# EAGLE design scsi2sd (EAGLE 9.1.0)
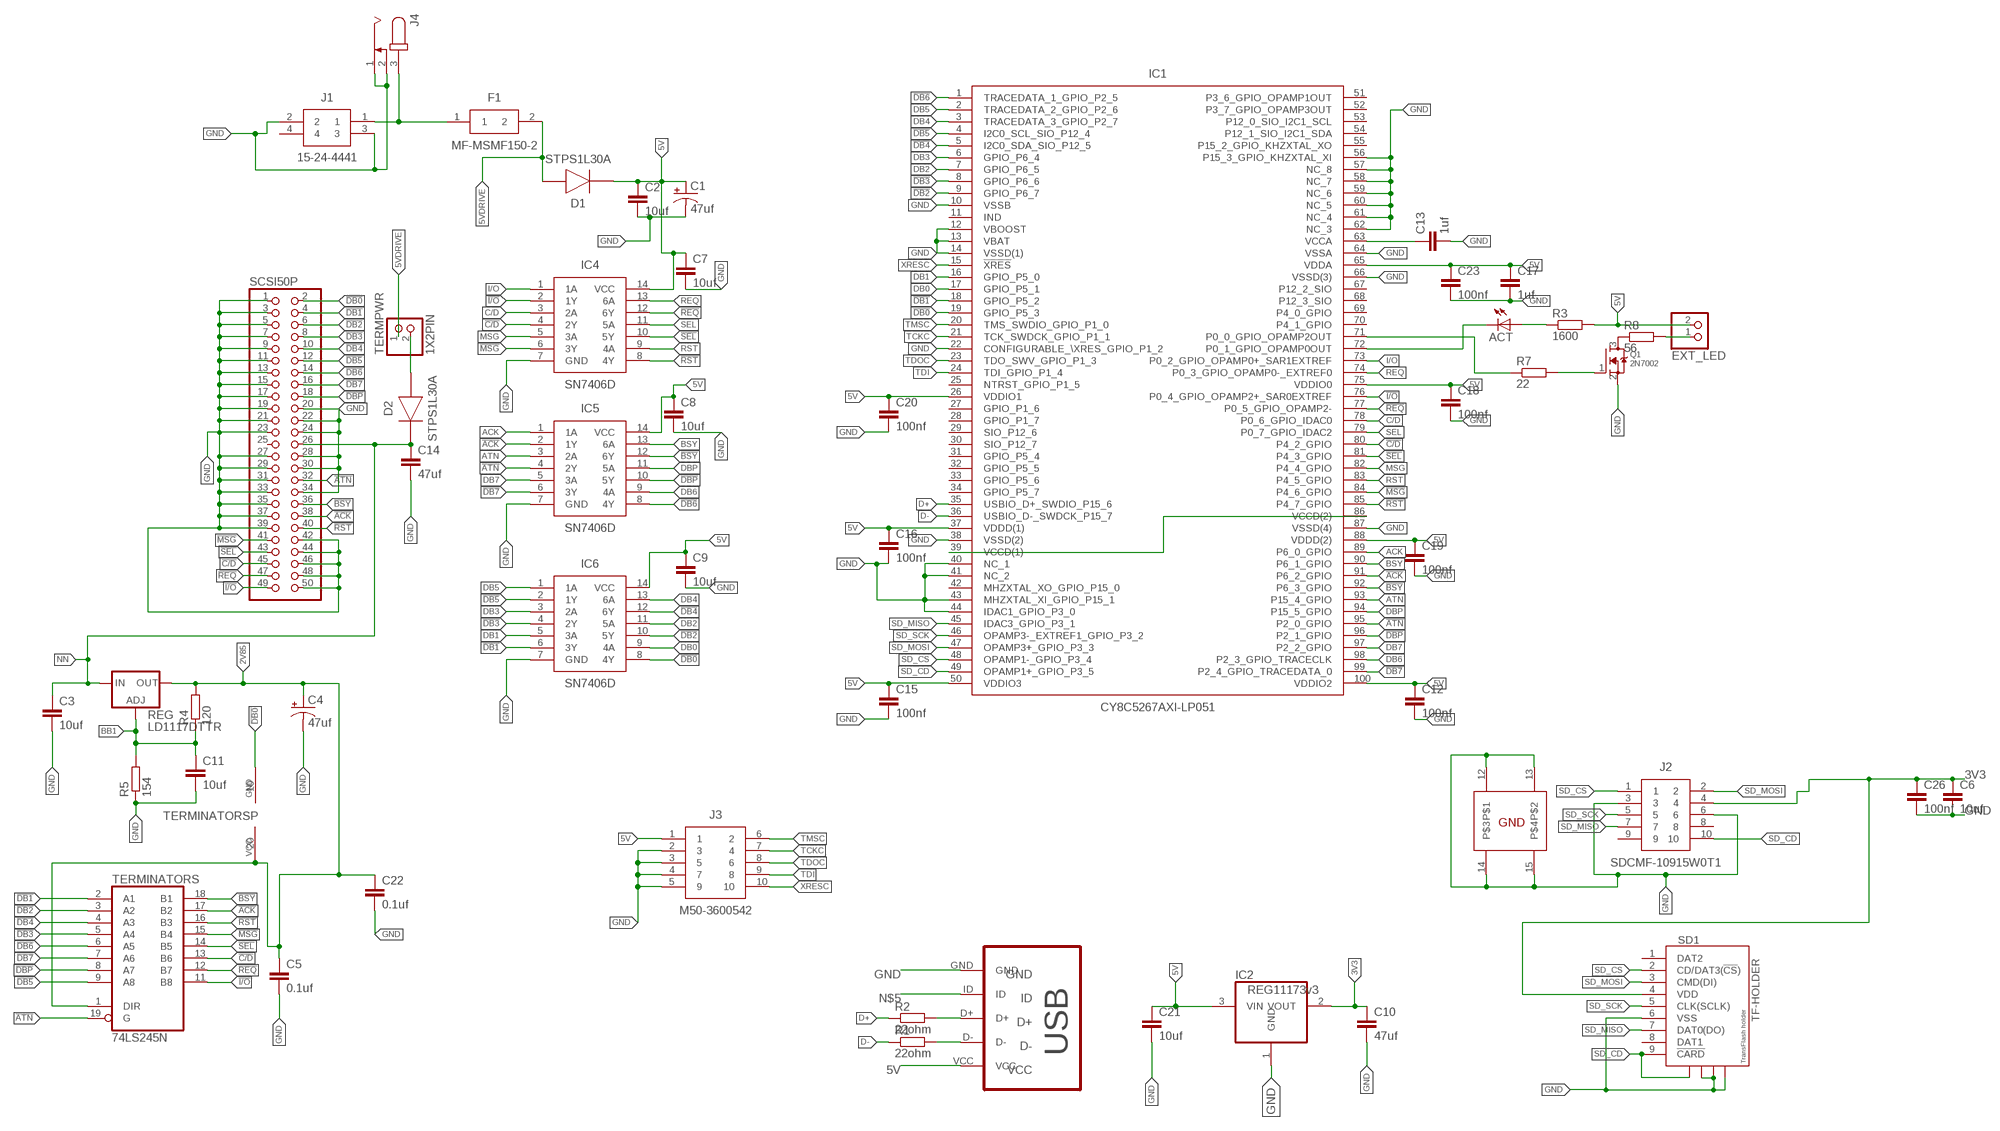
[diagram p0: schematic, sheet 1]

## Parts
ACT  LEDCHIPLED_0805  [CHIPLED_0805]
C1  47uf  CPOL-USE2.5-5  [E2,5-5]
C2  10uf  C-EUC0603  [C0603]
C3  10uf  C-EUC0603  [C0603]
C4  47uf  CPOL-USE2.5-5  [E2,5-5]
C5  0.1uf  C-EUC0603  [C0603]
C6  10uf  C-EUC0603  [C0603]
C7  10uf  C-EUC0603  [C0603]
C8  10uf  C-EUC0603  [C0603]
C9  10uf  C-EUC0603  [C0603]
C10  47uf  C-EUC0603  [C0603]
C11  10uf  C-EUC0603  [C0603]
C12  100nf  C-EUC0603  [C0603]
C13  1uf  C-EUC0603  [C0603]
C14  47uf  C-EUC1206  [C1206]
C15  100nf  C-EUC0603  [C0603]
C16  100nf  C-EUC0603  [C0603]
C17  1uf  C-EUC0603  [C0603]
C18  100nf  C-EUC0603  [C0603]
C19  100nf  C-EUC0603  [C0603]
C20  100nf  C-EUC0603  [C0603]
C21  10uf  C-EUC0603  [C0603]
C22  0.1uf  C-EUC0603  [C0603]
C23  100nf  C-EUC0603  [C0603]
C26  100nf  C-EUC0603  [C0603]
D1  STPS1L30A  [DIOM5226X223N]
D2  STPS1L30A  [DIOM5226X223N]
EXT_LED  1X2PIN  [1X2PIN]
F1  MF-MSMF150-2  [FUSC4632X85N]
IC1  CY8C5267AXI-LP051  [TQFP50P1600X1600X160-100N]
IC2  REG11173v3  REG1117  [SOT223]
IC4  SN7406D  [SOIC127P600X175-14N]
IC5  SN7406D  [SOIC127P600X175-14N]
IC6  SN7406D  [SOIC127P600X175-14N]
J1  15-24-4441  [15-24-4441]
J2  SDCMF-10915W0T1  [SDCMF-10915W0T1]
J3  M50-3600542  [HARWIN_10PIN_1.27PITCH_SMD]
J4  RAPC7120  [RAPC712]
Q1  2N7002  MOSFET-NREFLOW  [SOT23]
R1  22ohm  R-EU_R0603  [R0603]
R2  22ohm  R-EU_R0603  [R0603]
R3  1600  R-EU_R0603  [R0603]
R4  120  R-EU_R0603  [R0603]
R5  154  R-EU_R0603  [R0603]
R7  22  R-EU_R0603  [R0603]
R8  56  R-EU_R0603  [R0603]
REG  LD1117DTTR  LD117ADT12TR  [DPACK]
SCSI50P  PINHD-2X25/90  [2X25/90]
SD1  TF-HOLDER  [TF-PULL]
TERMINATORS  74LS245N  [DIL20]
TERMPWR  1X2PIN  [1X2PIN]
USB  MICRO-USB-B  [MICRO_USB_4_LEGS]

## Nets
2V85 [5V]: C4.+ C5.1 C22.1 R4.2 REG.4(OUT) TERMINATORS.1(DIR) TERMINATORS.20(VCC)
3V3 [2V85]: C6.1 C10.1 C26.1 IC2.2(VOUT) J2.4 SD1.4(VDD)
5V [5V]: C1.+ C2.1 C7.1 C8.1 C9.1 C12.1 C15.1 C16.1 C17.1 C18.1 C19.1 C20.1 C21.1 C23.1 D1.1(K) EXT_LED.2 IC1.26(VDDIO1) IC1.37(VDDD(1)) IC1.50(VDDIO3) IC1.65(VDDA) IC1.75(VDDIO0) IC1.88(VDDD(2)) IC1.100(VDDIO2) IC2.3(VIN) IC4.14(VCC) IC5.14(VCC) IC6.14(VCC) J3.1 R3.2 USB.VCC
5VDRIVE [5V]: D1.2(A) F1.2 TERMPWR.1
!ACK: IC1.91(P6_2_GPIO) IC5.2(1Y) SCSI50P.38 TERMINATORS.17(B2)
!ATN: IC1.95(P2_0_GPIO) IC5.4(2Y) SCSI50P.32 TERMINATORS.19(G)
!BSY: IC1.92(P6_3_GPIO) IC5.12(6Y) SCSI50P.36 TERMINATORS.18(B1)
!C/D: IC1.80(P4_2_GPIO) IC4.4(2Y) SCSI50P.45 TERMINATORS.13(B6)
!DB0: IC1.19(GPIO_P5_3) IC6.8(4Y) SCSI50P.2 TERMINATORS.10(GND)
!DB1: IC1.18(GPIO_P5_2) IC6.6(3Y) SCSI50P.4 TERMINATORS.2(A1)
!DB2: IC1.9(GPIO_P6_7) IC6.10(5Y) SCSI50P.6 TERMINATORS.3(A2)
!DB3: IC1.8(GPIO_P6_6) IC6.4(2Y) SCSI50P.8 TERMINATORS.5(A4)
!DB4: IC1.5(I2C0_SDA_SIO_P12_5) IC6.12(6Y) SCSI50P.10 TERMINATORS.4(A3)
!DB5: IC1.4(I2C0_SCL_SIO_P12_4) IC6.2(1Y) SCSI50P.12 TERMINATORS.9(A8)
!DB6: IC1.1(TRACEDATA_1_GPIO_P2_5) IC5.8(4Y) SCSI50P.14 TERMINATORS.6(A5)
!DB7: IC1.99(P2_4_GPIO_TRACEDATA_0) IC5.6(3Y) SCSI50P.16 TERMINATORS.7(A6)
!DBP: IC1.96(P2_1_GPIO) IC5.10(5Y) SCSI50P.18 TERMINATORS.8(A7)
!I/O: IC1.76(P0_4_GPIO_OPAMP2+_SAR0EXTREF) IC4.2(1Y) SCSI50P.49 TERMINATORS.11(B8)
!MSG: IC1.84(P4_6_GPIO) IC4.6(3Y) SCSI50P.41 TERMINATORS.15(B4)
!REQ: IC1.77(P0_5_GPIO_OPAMP2-) IC4.12(6Y) SCSI50P.47 TERMINATORS.12(B7)
!RST: IC1.85(P4_7_GPIO) IC4.8(4Y) SCSI50P.40 TERMINATORS.16(B3)
!SEL: IC1.81(P4_3_GPIO) IC4.10(5Y) SCSI50P.43 TERMINATORS.14(B5)
ACK: IC1.89(P6_0_GPIO) IC5.1(1A)
ATN: IC1.93(P15_4_GPIO) IC5.3(2A)
BB1 [GND]: C11.1 R4.1 R5.2 REG.1(ADJ)
BSY: IC1.90(P6_1_GPIO) IC5.13(6A)
C/D: IC1.78(P0_6_GPIO_IDAC0) IC4.3(2A)
D+: IC1.35(USBIO_D+_SWDIO_P15_6) R2.1
D-: IC1.36(USBIO_D-_SWDCK_P15_7) R1.1
DB0: IC1.17(GPIO_P5_1) IC6.9(4A)
DB1: IC1.16(GPIO_P5_0) IC6.5(3A)
DB2: IC1.7(GPIO_P6_5) IC6.11(5A)
DB3: IC1.6(GPIO_P6_4) IC6.3(2A)
DB4: IC1.3(TRACEDATA_3_GPIO_P2_7) IC6.13(6A)
DB5: IC1.2(TRACEDATA_2_GPIO_P2_6) IC6.1(1A)
DB6: IC1.98(P2_3_GPIO_TRACECLK) IC5.9(4A)
DB7: IC1.97(P2_2_GPIO) IC5.5(3A)
DBP: IC1.94(P15_5_GPIO) IC5.11(5A)
GND [GND]: C1.- C2.2 C3.2 C4.- C5.2 C6.2 C7.2 C8.2 C9.2 C10.2 C11.2 C12.2 C13.2 C14.2 C15.2 C16.2 C17.2 C18.2 C19.2 C20.2 C21.2 C22.2 C23.2 C26.2 IC1.10(VSSB) IC1.12(VBOOST) IC1.13(VBAT) IC1.14(VSSD(1)) IC1.22(CONFIGURABLE_\XRES_GPIO_P1_2) IC1.38(VSSD(2)) IC1.40(NC_1) IC1.41(NC_2) IC1.43(MHZXTAL_XI_GPIO_P15_1) IC1.44(IDAC1_GPIO_P3_0) IC1.56(P15_3_GPIO_KHZXTAL_XI) IC1.57(NC_8) IC1.58(NC_7) IC1.59(NC_6) IC1.60(NC_5) IC1.61(NC_4) IC1.62(NC_3) IC1.64(VSSA) IC1.66(VSSD(3)) IC1.87(VSSD(4)) IC2.1(GND) IC4.7(GND) IC5.7(GND) IC6.7(GND) J1.2 J1.3 J2.3 J2.6 J2.12 J2.13 J2.14 J2.15 J3.2 J3.3 J3.4 J3.5 J4.1 J4.2 Q1.2(S) R5.1 SCSI50P.1 SCSI50P.3 SCSI50P.5 SCSI50P.7 SCSI50P.9 SCSI50P.11 SCSI50P.13 SCSI50P.15 SCSI50P.17 SCSI50P.19 SCSI50P.20 SCSI50P.21 SCSI50P.22 SCSI50P.23 SCSI50P.24 SCSI50P.27 SCSI50P.28 SCSI50P.29 SCSI50P.30 SCSI50P.31 SCSI50P.33 SCSI50P.34 SCSI50P.35 SCSI50P.37 SCSI50P.39 SCSI50P.42 SCSI50P.44 SCSI50P.46 SCSI50P.48 SCSI50P.50 SD1.6(VSS) SD1.S2 SD1.S3 SD1.S4 USB.GND
I/O: IC1.73(P0_2_GPIO_OPAMP0+_SAR1EXTREF) IC4.1(1A)
MSG: IC1.82(P4_4_GPIO) IC4.5(3A)
N$1: F1.1 J1.1 J4.3
N$2: R2.2 USB.D+
N$3: R1.2 USB.D-
N$5: USB.ID
N$6: ACT.A R3.1
N$7: IC1.71(P0_0_GPIO_OPAMP2OUT) R7.1
N$8: D2.2(A) TERMPWR.2
N$9: IC1.39(VCCD(1)) IC1.86(VCCD(2))
N$10: Q1.1(G) R7.2
N$12: Q1.3(D) R8.1
N$16: EXT_LED.1 R8.2
N$34: C13.1 IC1.63(VCCA)
N$35: ACT.C IC1.72(P0_1_GPIO_OPAMP0OUT)
NN [5V]: C3.1 C14.1 D2.1(K) REG.3(IN) SCSI50P.26
REQ: IC1.74(P0_3_GPIO_OPAMP0-_EXTREF0) IC4.13(6A)
RST: IC1.83(P4_5_GPIO) IC4.9(4A)
SD_CD: IC1.49(OPAMP1+_GPIO_P3_5) J2.10 SD1.9(!CARD) SD1.S1
SD_CS: IC1.48(OPAMP1-_GPIO_P3_4) J2.1 SD1.2(CD/DAT3(!CS!))
SD_MISO: IC1.45(IDAC3_GPIO_P3_1) J2.7 SD1.7(DAT0(DO))
SD_MOSI: IC1.47(OPAMP3+_GPIO_P3_3) J2.2 SD1.3(CMD(DI))
SD_SCK: IC1.46(OPAMP3-_EXTREF1_GPIO_P3_2) J2.5 SD1.5(CLK(SCLK))
SEL: IC1.79(P0_7_GPIO_IDAC2) IC4.11(5A)
TCKC: IC1.21(TCK_SWDCK_GPIO_P1_1) J3.7
TDI: IC1.24(TDI_GPIO_P1_4) J3.9
TDOC: IC1.23(TDO_SWV_GPIO_P1_3) J3.8
TMSC: IC1.20(TMS_SWDIO_GPIO_P1_0) J3.6
XRESC: IC1.15(!XRES) J3.10
Unconnected: IC1.11(IND) IC1.25(NTRST_GPIO_P1_5) IC1.27(GPIO_P1_6) IC1.28(GPIO_P1_7) IC1.29(SIO_P12_6) IC1.30(SIO_P12_7) IC1.31(GPIO_P5_4) IC1.32(GPIO_P5_5) IC1.33(GPIO_P5_6) IC1.34(GPIO_P5_7) IC1.42(MHZXTAL_XO_GPIO_P15_0) IC1.51(P3_6_GPIO_OPAMP1OUT) IC1.52(P3_7_GPIO_OPAMP3OUT) IC1.53(P12_0_SIO_I2C1_SCL) IC1.54(P12_1_SIO_I2C1_SDA) IC1.55(P15_2_GPIO_KHZXTAL_XO) IC1.67(P12_2_SIO) IC1.68(P12_3_SIO) IC1.69(P4_0_GPIO) IC1.70(P4_1_GPIO) J1.4 J2.8 J2.9 SCSI50P.25 SD1.1(DAT2) SD1.8(DAT1)

## Library data of the parts
ACT = adafruit:LED: LED OSRAM: - CHIPLED LG R971, LG N971, LY N971, LG Q971, LY Q971, LO R971, LY R971 LH N974, LH R974 LS Q976, LO Q976, LY Q976 LO Q996 - Hyper CHIPLED LW Q18S LB Q993, LB Q99A, LB R99A - SideLED LS A670, LO A670, LY A670, LG A670, LP A670 LB A673, LV A673, LT A673, LW A673 LH A674 LY A675 LS A676, LA A676, LO A676, LY A676, LW A676 LS A679, LY A679, LG A679 - Hyper Micro SIDELED® LS Y876, LA Y876, LO Y876, LY Y876 LT Y87S - SmartLED LW L88C, LW L88S LB L89C, LB L89S, LG L890 LS L89K, LO L89K, LY L89K LS L896, LA L896, LO L896, LY L896 - TOPLED LS T670, LO T670, LY T670, LG T670, LP T670 LSG T670, LSP T670, LSY T670, LOP T670, LYG T670 LG T671, LOG T671, LSG T671 LB T673, LV T673, LT T673, LW T673 LH T674 LS T676, LA T676, LO T676, LY T676, LB T676, LH T676, LSB T676, LW T676 LB T67C, LV T67C, LT T67C, LS T67K, LO T67K, LY T67K, LW E67C LS E67B, LA E67B, LO E67B, LY E67B, LB E67C, LV E67C, LT E67C LW T67C LS T679, LY T679, LG T679 LS T770, LO T770, LY T770, LG T770, LP T770 LB T773, LV T773, LT T773, LW T773 LH T774 LS E675, LA E675, LY E675, LS T675 LS T776, LA T776, LO T776, LY T776, LB T776 LHGB T686 LT T68C, LB T68C - Hyper Mini TOPLED® LB M676 - Mini TOPLED Santana® LG M470 LS M47K, LO M47K, LY M47K Source: http://www.osram.convergy.de/
C1 C4 = adafruit:CPOL-US: POLARIZED CAPACITOR, American symbol
C2 C3 C5-C23 C26 = rcl:C-EU: CAPACITOR, European symbol
D1 D2 = STPS1L30A:STPS1L30A: Schottky barrier diode,STPS1L30A SMA STMicroelectronics STPS1L30A, SMT Schottky Diode, 30V 1A, 2-Pin DO-214AC <https://componentsearchengine.com/Images/3/STPS1L30A.jpg> Source: Datasheet <http://www.st.com/web/en/resource/technical/document/datasheet/CD00001323.pdf>; DESCRIPTION: Schottky barrier diode,STPS1L30A SMA STMicroelectronics STPS1L30A, SMT Schottky Diode, 30V 1A, 2-Pin DO-214AC; HEIGHT: 2.23mm; MANUFACTURER_NAME: STMicroelectronics; MANUFACTURER_PART_NUMBER: STPS1L30A; RS_PART_NUMBER: 4858061; SUPPLIER_NAME: RS
EXT_LED = a3640_edu_v0.1:1X2PIN: 1 X 2 PIN
F1 = MF-MSMF150-2:MF-MSMF150-2: Fuse, PTC, Resettable, SMD, 1812, 1.5A Bourns 1.5A Surface Mount Resettable Fuse, 6 V <https://componentsearchengine.com/Images/3/MF-MSMF150-2.jpg> Source: Datasheet <https://componentsearchengine.com/Datasheets/2/MF-MSMF150-2.pdf>; DESCRIPTION: Fuse, PTC, Resettable, SMD, 1812, 1.5A Bourns 1.5A Surface Mount Resettable Fuse, 6 V; HEIGHT: 0.85mm; MANUFACTURER_NAME: Bourns; MANUFACTURER_PART_NUMBER: MF-MSMF150-2; RS_PART_NUMBER: 6478235; SUPPLIER_NAME: RS
IC1 = CY8C5267AXI-LP051:CY8C5267AXI-LP051: CY8C52LP Family <https://componentsearchengine.com/Images/1/CY8C5267AXI-LP051.jpg> Source: Datasheet <http://www.cypress.com/file/45936/download>; DESCRIPTION: CY8C52LP Family; HEIGHT: mm; MANUFACTURER_NAME: Cypress Semiconductor; MANUFACTURER_PART_NUMBER: CY8C5267AXI-LP051; RS_PART_NUMBER: 8282749; SUPPLIER_NAME: RS
IC2 = burr-brown:REG1117: 800mA and 1A Low Dropout (LDO) Positive Regulator 1.8V, 2.5V, 2.85V, 3.3V, 5V, and Adj; MPN: REG1117; OC_FARNELL: 1097566; OC_NEWARK: 14P6981
IC4-IC6 = SN7406D:SN7406D: SN7406D, Hex Inverter Buffer, Driver, Open Collector 40mA 5V 14-Pin SOIC <https://componentsearchengine.com/Images/3/SN7406D.jpg> Source: Datasheet <http://www.ti.com/lit/ds/symlink/sn7406.pdf>; DESCRIPTION: SN7406D, Hex Inverter Buffer, Driver, Open Collector 40mA 5V 14-Pin SOIC; HEIGHT: 1.75mm; MANUFACTURER_NAME: Texas Instruments; MANUFACTURER_PART_NUMBER: SN7406D; RS_PART_NUMBER: 6630739; SUPPLIER_NAME: RS
J1 = 15-24-4441:15-24-4441: 5.08mm Pitch Disk Drive Power Connection System Header <https://componentsearchengine.com/Images/3/15-24-4441.jpg> Source: Datasheet <http://docs-europe.electrocomponents.com/webdocs/13c2/0900766b813c2c8c.pdf>; DESCRIPTION: 5.08mm Pitch Disk Drive Power Connection System Header; HEIGHT: mm; MANUFACTURER_NAME: Molex; MANUFACTURER_PART_NUMBER: 15-24-4441; RS_PART_NUMBER: 6704256; SUPPLIER_NAME: RS
J2 = SDCMF-10915W0T1:SDCMF-10915W0T1: MULTICOMP - SDCMF-10915W0T1 - CONNECTOR, SD, METAL COVER, SMT, R/A Source: Datasheet <http://www.farnell.com/datasheets/12099.pdf>; DESCRIPTION: MULTICOMP - SDCMF-10915W0T1 - CONNECTOR, SD, METAL COVER, SMT, R/A; HEIGHT: mm; MANUFACTURER_NAME: MULTICOMP; MANUFACTURER_PART_NUMBER: SDCMF-10915W0T1; SUPPLIER_NAME: RS
J3 = M50-3600542:M50-3600542: HARWIN M50-36 Series, 1.27mm Pitch 10 Way 2 Row Straight PCB Header, Solder Termination, 1A <https://componentsearchengine.com/Images/3/M50-3600542.jpg> Source: Datasheet <http://docs-europe.electrocomponents.com/webdocs/1388/0900766b81388736.pdf>; DESCRIPTION: HARWIN M50-36 Series, 1.27mm Pitch 10 Way 2 Row Straight PCB Header, Solder Termination, 1A; HEIGHT: mm; MANUFACTURER_NAME: HARWIN; MANUFACTURER_PART_NUMBER: M50-3600542; RS_PART_NUMBER: 1224772; SUPPLIER_NAME: RS
J4 = RepRapjr:RAPC712: DC POWER JACK Power Jack, DC, Right Angle, Through Hole, Rated 5A at 16VDC, PC Terminals Distributor: Farnell (www.Farnell.de) Drawing: 84N1161.pdf / 84N1162.pdf Manufacturer: SPC Technology (www.spctechnology.com) Type: SPC4077 / SPC 4078
Q1 = TiLDA Mk3 Parts:MOSFET-N: N-Channel Mosfet 2N7002E - 60V 260mA SOT23 [Digikey: 2N7002ET1GOSTR-ND] - REEL BSH103 - 30V 850mA SOT23 [Digikey: 568-5013-1-ND]
R1-R5 R7 R8 = rcl:R-EU_: RESISTOR, European symbol
REG = v-reg:LD117A?*: Low drop fixed and adjustable positive voltage regulators 1 A Source: http://www.st.com/stonline/products/literature/ds/7194/ld1117axx.pdf
SCSI50P = pinhead:PINHD-2X25: PIN HEADER
SD1 = sd-mmc:TF-HOLDER: TF / Micro SD socket is PUSH-PUSH type, the card can be pushed into and auto locked and pushed out by simply press the card. Surface Mounting type.
TERMINATORS = 74xx-us:74*245: Octal BUS TRANSCEIVER, 3-state
TERMPWR = edu:1X2PIN: 1 X 2 PIN
USB = micro usb B - 4LEGS:MICRO-USB-B

## Net classes
1 5V: width 0.305 mm
2 GND: width 0.279 mm
3 2V85: width 0.406 mm

## Board
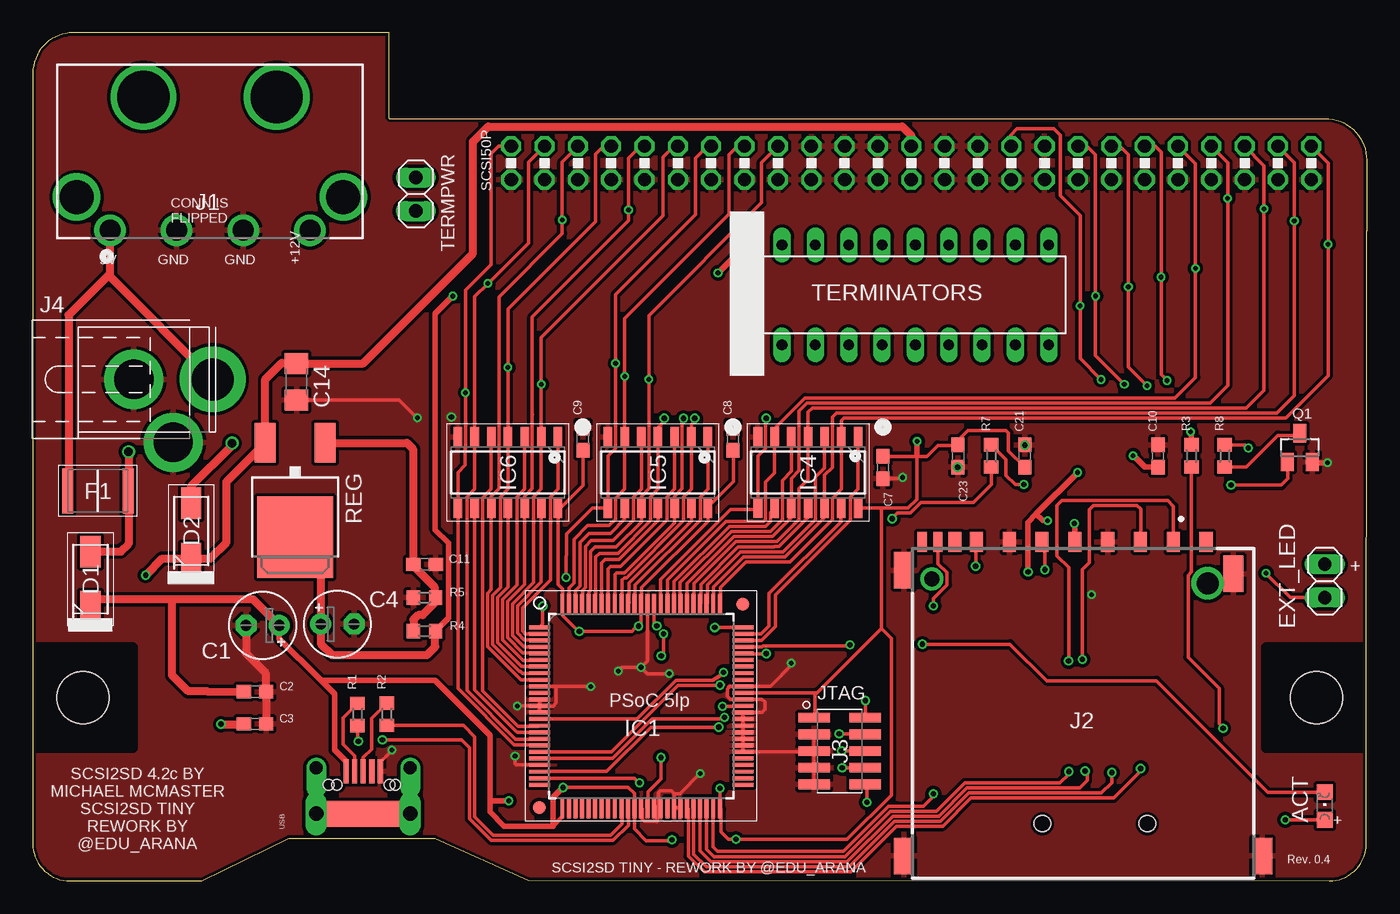
[diagram p1: board, top side]
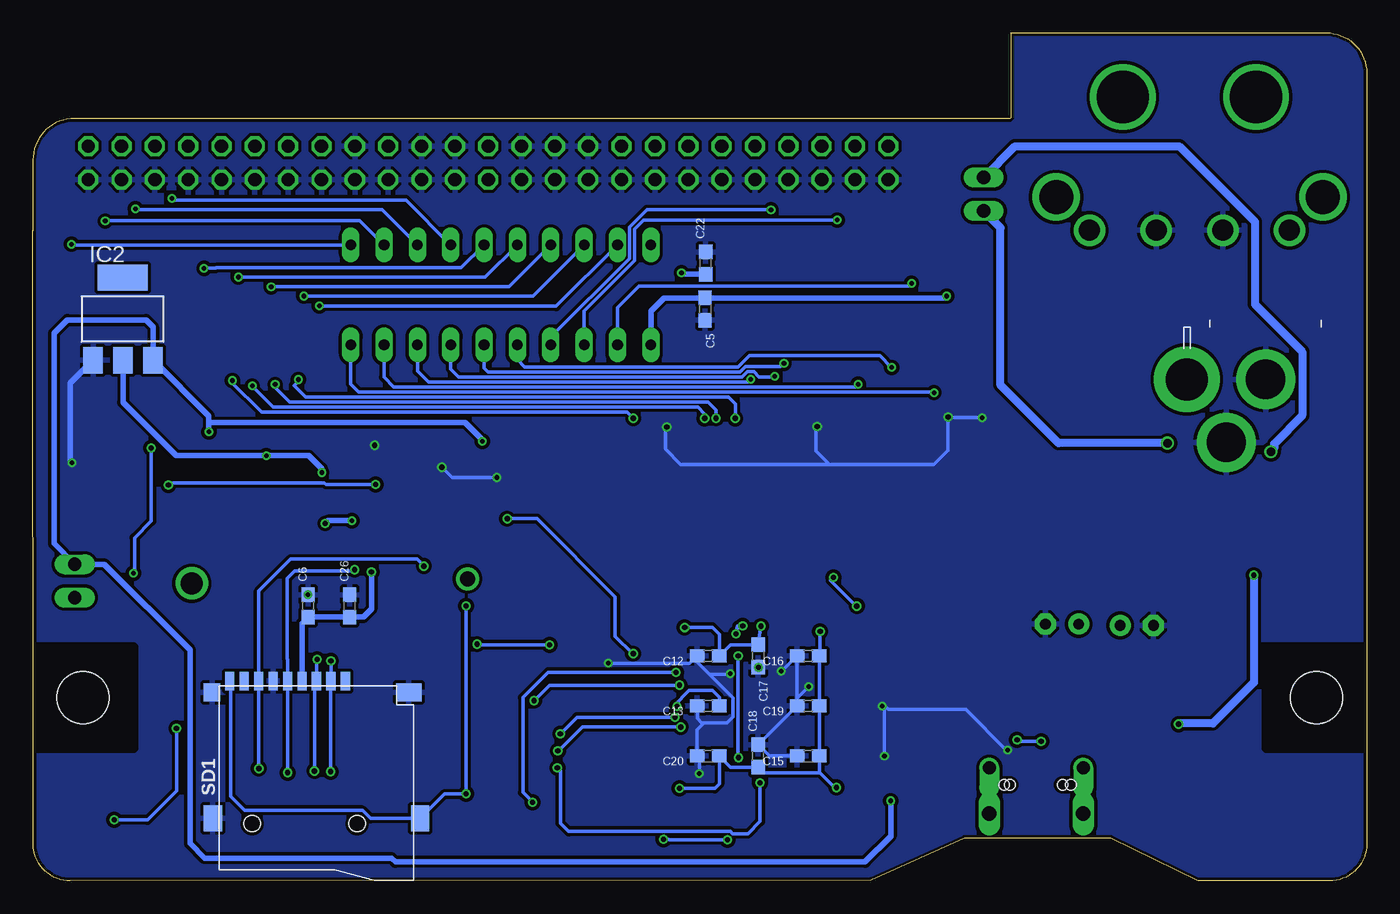
[diagram p2: board, bottom side, seen from below]

Size 101.62 x 64.63 mm. Coordinates in mm from the lower left corner, seen from the top.
Outline: 101.62,49.55 101.58,2.82 arc-90 98.76,0 37.75,0.05 30.63,3.25 19.51,3.25 12.85,0 2.84,0 arc-90 0,2.84 0,61.55 arc-90 3.07,64.63 27.13,64.62
Outline: 27.2,58.09 98.45,58.09 arc-90 101.62,54.93 101.62,49.51
Outline: 27.12,64.62 27.12,58.16 27.2,58.09
Copper layers (1*16): Top 0.035mm / dielectric 1.5mm / Bottom 0.035mm
Design rules "dirt_cheap_dirty_boards.v1 *": minimum track width 8mil, minimum drill 12mil, track to track 5mil, track to pad 5mil, pad to pad 5mil, via to via 5mil, smd to smd 0mil, copper to edge 10mil, drill to drill 10mil, minimum pad ring 10mil, minimum via ring 6mil, stop-mask expansion 2mil, vias tented up to drill 25mil, thermal gap 10mil
Holes 3.99 mm at 3.81,13.97 97.79,13.97
tRestrict: area 0,10.2 to 7.6,17.8; area 94,10.2 to 101.6,17.8
bRestrict: area 0,10.2 to 7.6,17.8; area 94,10.2 to 101.6,17.8

### Footprints (pad centres in the part's own frame; a part is rotated, then mirrored left to right if it is on the bottom)
CHIPLED_0805 = smd 1.2 x 1.2: A 0,-1.05; C 0,1.05
E2,5-5 = drill 0.813 pad 1.6: + -1.27,0 | drill 0.813 pad 1.6 octagon: - 1.27,0
C0603 = smd 1.1 x 1: 1 -0.85,0; 2 0.85,0
C1206 = smd 1.6 x 1.8: 1 -1.4,0; 2 1.4,0
DIOM5226X223N = smd 2.4 x 1.55: 1 -2.1,0; 2 2.1,0
1X2PIN = drill 1.016 long: 1 -1.27,0; 2 1.27,0
FUSC4632X85N = smd 0.85 x 3.43: 1 -2.3,0; 2 2.3,0
TQFP50P1600X1600X160-100N = smd 1.6 x 0.3: 1 -7.75,6; 2 -7.75,5.5; 3 -7.75,5; 4 -7.75,4.5; 5 -7.75,4; 6 -7.75,3.5; 7 -7.75,3; 8 -7.75,2.5; 9 -7.75,2; 10 -7.75,1.5; 11 -7.75,1; 12 -7.75,0.5; 13 -7.75,0; 14 -7.75,-0.5; 15 -7.75,-1; 16 -7.75,-1.5; 17 -7.75,-2; 18 -7.75,-2.5; 19 -7.75,-3; 20 -7.75,-3.5; 21 -7.75,-4; 22 -7.75,-4.5; 23 -7.75,-5; 24 -7.75,-5.5; 25 -7.75,-6; 51 7.75,-6; 52 7.75,-5.5; 53 7.75,-5; 54 7.75,-4.5; 55 7.75,-4; 56 7.75,-3.5; 57 7.75,-3; 58 7.75,-2.5; 59 7.75,-2; 60 7.75,-1.5; 61 7.75,-1; 62 7.75,-0.5; 63 7.75,0; 64 7.75,0.5; 65 7.75,1; 66 7.75,1.5; 67 7.75,2; 68 7.75,2.5; 69 7.75,3; 70 7.75,3.5; 71 7.75,4; 72 7.75,4.5; 73 7.75,5; 74 7.75,5.5; 75 7.75,6 | smd 0.3 x 1.6: 26 -6,-7.75; 27 -5.5,-7.75; 28 -5,-7.75; 29 -4.5,-7.75; 30 -4,-7.75; 31 -3.5,-7.75; 32 -3,-7.75; 33 -2.5,-7.75; 34 -2,-7.75; 35 -1.5,-7.75; 36 -1,-7.75; 37 -0.5,-7.75; 38 0,-7.75; 39 0.5,-7.75; 40 1,-7.75; 41 1.5,-7.75; 42 2,-7.75; 43 2.5,-7.75; 44 3,-7.75; 45 3.5,-7.75; 46 4,-7.75; 47 4.5,-7.75; 48 5,-7.75; 49 5.5,-7.75; 50 6,-7.75; 76 6,7.75; 77 5.5,7.75; 78 5,7.75; 79 4.5,7.75; 80 4,7.75; 81 3.5,7.75; 82 3,7.75; 83 2.5,7.75; 84 2,7.75; 85 1.5,7.75; 86 1,7.75; 87 0.5,7.75; 88 0,7.75; 89 -0.5,7.75; 90 -1,7.75; 91 -1.5,7.75; 92 -2,7.75; 93 -2.5,7.75; 94 -3,7.75; 95 -3.5,7.75; 96 -4,7.75; 97 -4.5,7.75; 98 -5,7.75; 99 -5.5,7.75; 100 -6,7.75 | smd 1 x 1: 101 7.76,7.76; 102 -7.76,-7.76
SOT223 = smd 1.499 x 2.007: 1 -2.261,-3.15; 2 0.025,-3.15; 3 2.311,-3.15 | smd 3.81 x 2.007: 4 0,3.15
SOIC127P600X175-14N = smd 1.525 x 0.65: 1 -2.712,3.81; 2 -2.712,2.54; 3 -2.712,1.27; 4 -2.712,0; 5 -2.712,-1.27; 6 -2.712,-2.54; 7 -2.712,-3.81; 8 2.712,-3.81; 9 2.712,-2.54; 10 2.712,-1.27; 11 2.712,0; 12 2.712,1.27; 13 2.712,2.54; 14 2.712,3.81
15-24-4441 = drill 1.6 pad 2.4: 1 -7.62,0; 2 -2.54,0; 3 2.54,0; 4 7.62,0 | drill 2.59 pad 2.59: 5 -10.16,2.54; 6 10.16,2.54 | drill 3.99 pad 3.99: 7 -5.08,10.16; 8 5.08,10.16
SDCMF-10915W0T1 = smd 1 x 1.5: 1 6.875,23.92; 2 4.375,23.92; 3 1.875,23.92; 4 -0.625,23.92; 5 -3.125,23.92; 6 -5.625,23.92; 7 -8.125,23.92; 8 -9.75,23.92; 9 9.375,23.92 | smd 0.7 x 1.5: 10 -11.05,23.92; 11 -12.25,23.92 | smd 1.5 x 2.8: 12 -13.65,21.767; 13 11.45,21.5; 14 -13.65,0; 15 13.65,0 | drill 1.15 pad 1.75: 16 -11.5,21.12 | drill 1.65 pad 2.3: 17 9.5,20.77
HARWIN_10PIN_1.27PITCH_SMD = smd 0.74 x 2.4: 1 -2.54,-1.95; 2 -1.27,-1.95; 3 0,-1.95; 4 1.27,-1.95; 5 2.54,-1.95; 6 -2.54,1.95; 7 -1.27,1.95; 8 0,1.95; 9 1.27,1.95; 10 2.54,1.95
RAPC712 = drill 3 pad 4.5: 1 -3,0; 2 0,-4.8 | drill 3.2 pad 5: 3 3,0
SOT23 = smd 1 x 1.4: 1 -0.95,-1.1; 2 0.95,-1.1; 3 0,1.1
R0603 = smd 1 x 1.1: 1 -0.85,0; 2 0.85,0
DPACK = smd 1.6 x 3: 1 -2.28,-4.8; 3 2.28,-4.8 | smd 5.8 x 6.2: 4 0,2.38
2X25/90 = drill 1.016 octagon: 1 -29.21,-6.35; 2 -29.21,-3.81; 3 -26.67,-6.35; 4 -26.67,-3.81; 5 -24.13,-6.35; 6 -24.13,-3.81; 7 -21.59,-6.35; 8 -21.59,-3.81; 9 -19.05,-6.35; 10 -19.05,-3.81; 11 -16.51,-6.35; 12 -16.51,-3.81; 13 -13.97,-6.35; 14 -13.97,-3.81; 15 -11.43,-6.35; 16 -11.43,-3.81; 17 -8.89,-6.35; 18 -8.89,-3.81; 19 -6.35,-6.35; 20 -6.35,-3.81; 21 -3.81,-6.35; 22 -3.81,-3.81; 23 -1.27,-6.35; 24 -1.27,-3.81; 25 1.27,-6.35; 26 1.27,-3.81; 27 3.81,-6.35; 28 3.81,-3.81; 29 6.35,-6.35; 30 6.35,-3.81; 31 8.89,-6.35; 32 8.89,-3.81; 33 11.43,-6.35; 34 11.43,-3.81; 35 13.97,-6.35; 36 13.97,-3.81; 37 16.51,-6.35; 38 16.51,-3.81; 39 19.05,-6.35; 40 19.05,-3.81; 41 21.59,-3.81; 42 21.59,-6.35; 43 24.13,-3.81; 44 24.13,-6.35; 45 26.67,-3.81; 46 26.67,-6.35; 47 29.21,-3.81; 48 29.21,-6.35; 49 31.75,-3.81; 50 31.75,-6.35
TF-PULL = smd 0.7 x 1.4: 1 -2.2,-7.62; 2 -1.1,-7.62; 3 0,-7.62; 4 1.1,-7.62; 5 2.2,-7.62; 6 3.3,-7.62; 7 4.4,-7.62; 8 5.5,-7.62; 9 6.6,-7.62 | smd 1.4 x 2: S1 -7.9,2.85; S2 7.9,2.85 | smd 1.28 x 1.4: S3 7.96,-6.75 | smd 1.95 x 1.4: S4 -7.025,-6.75 | hole 1.25: -3.1,3.25; 4.9,3.25
DIL20 = drill 0.813 long: 1 -11.43,-3.81; 2 -8.89,-3.81; 3 -6.35,-3.81; 4 -3.81,-3.81; 5 -1.27,-3.81; 6 1.27,-3.81; 7 3.81,-3.81; 8 6.35,-3.81; 9 8.89,-3.81; 10 11.43,-3.81; 11 11.43,3.81; 12 8.89,3.81; 13 6.35,3.81; 14 3.81,3.81; 15 1.27,3.81; 16 -1.27,3.81; 17 -3.81,3.81; 18 -6.35,3.81; 19 -8.89,3.81; 20 -11.43,3.81
MICRO_USB_4_LEGS = smd 1.85 x 0.4: D+ 3.125,0; D- 3.125,0.65; GND 3.125,-1.3; ID 3.125,-0.65; VCC 3.125,1.3 | drill 1.1 pad 1.5 long: P$1 -0.1,3.575; P$2 -0.1,-3.575 | drill 1 pad 1.5 offset: P$3 3.4,3.575; P$5 3.4,-3.575 | smd 2 x 6: P$4 -0.1,0 | hole 0.8: 2.1,2; 2.1,-2; 2.1,2.635; 2.1,-2.445

### Placement (x,y rotation side)
ACT  98.42,5.71 0 top
C1  17.51,19.47 180 top
C2  16.93,14.42 0 top
C3  16.92,11.97 0 top
C4  23.21,19.57 0 top
C5  50.4,43.57 270 bottom
C6  80.64,20.95 90 bottom
C7  64.77,31.51 270 top
C8  53.34,33.66 90 top
C9  41.91,33.66 90 top
C10  85.73,32.38 90 top
C11  29.84,24.13 0 top
C12  50.16,17.14 180 bottom
C13  50.16,13.34 180 bottom
C14  20.08,38.03 270 top
C15  42.55,9.53 180 bottom
C16  42.55,17.14 180 bottom
C17  46.36,17.14 270 bottom
C18  46.36,9.53 90 bottom
C19  42.55,13.34 180 bottom
C20  50.16,9.53 180 bottom
C21  75.56,32.38 90 top
C22  50.35,47.08 90 bottom
C23  70.48,32.38 270 top
C26  77.47,20.95 90 bottom
D1  4.39,22.99 90 top
D2  12.06,26.67 90 top
EXT_LED  98.42,22.86 90 top
F1  4.96,29.72 0 top
IC1  46.34,13.34 0 top
IC2  94.77,42.82 0 bottom
IC4  59.06,31.11 270 top
IC5  47.62,31.11 270 top
IC6  36.2,31.11 270 top
J1  13.5,49.57 0 top
J2  80.01,1.91 0 top
J3  61.47,9.9 270 top
J4  10.7,38.22 0 top
Q1  96.52,33.02 0 top
R1  24.74,12.69 90 top
R2  26.98,12.7 90 top
R3  88.27,32.38 90 top
R4  29.84,19.04 0 top
R5  29.84,21.59 0 top
R7  73.03,32.38 90 top
R8  90.81,32.38 90 top
REG  19.99,28.57 180 top
SCSI50P  65.65,59.79 0 top
SD1  80.01,7.62 180 bottom
TERMINATORS  65.97,44.65 0 top
TERMPWR  29.18,52.33 270 top
USB  25.17,5.22 90 top

### Tracks (layer width: path | path; a pad name or v marks a point on that pad's centre or on a via)
2V85  (via drill 0.35)
  Top 0.254: R4.2
  Top 0.406: R4.2 31.68,20.03 31.68,25.74 30.66,26.76 30.66,43.24 v31.99,44.57 | TERMINATORS.1 TERMINATORS.20 54.33,48.46 v52.2,46.33
  Top 0.61: REG.4 21.94,24.24 C4.+ 21.94,18.08 22.8,17.22 30.03,17.22 30.65,17.84 30.65,18.99 R4.2
  Bottom 0.254: C5.1
  Bottom 0.406: v31.99,44.57 32.14,44.42 C5.1 53.53,44.42 54.54,43.42 TERMINATORS.1 | v52.2,46.33 52.1,46.23 C22.1
3V3  (via drill 0.35, 0.4)
  Top 0.254: 79.47,25.91 J2.4
  Top 0.406: C10.1 84.71,31.54 v83.83,32.41 | v79.61,31.12 76.43,27.95 | 76.43,27.95 75.82,27.33 v75.82,23.54 | 76.43,27.95 76.93,27.45 v77.31,27.45 | v79.35,27.24 79.39,27.2 J2.4
  Bottom 0.254: SD1.4 | 75.85,23.5 v75.82,23.54
  Bottom 0.406: IC2.2 94.75,36.46 90.7,32.41 v83.83,32.41 80.59,32.41 79.61,31.43 v79.61,31.12 | v77.31,27.45 79.13,27.45 v79.35,27.24 | v75.82,23.54 75.82,20.71 76.43,20.1 C26.1 C6.1 81.11,19.64 SD1.4
5V  (via drill 0.35, 0.4)
  Top 0.254: C9.1 41.93,32.78 41.93,30.14 40.2,28.4 IC6.14 40,22.59 40.34,22.25 IC1.100 40.34,20.27 41.59,19.02 v41.64,19.02 45.64,19.02 46.04,19.47 | C8.1 53.37,32.78 53.37,30.44 51.44,28.51 IC5.14 51.44,27.41 46.38,22.35 46.38,21.13 IC1.88 46.34,19.51 46.37,19.48 46.04,19.47 | 40.36,5.56 IC1.26 | 46.04,19.47 v46.14,19.41 | v40.39,7.12 45.36,7.12 45.83,6.66 45.83,5.59 IC1.37 45.84,3.96 46.72,3.07 48.63,3.07 v48.7,3.14 | v52.35,7.05 52.35,5.59 IC1.50 52.44,5.48 52.44,3.74 53.01,3.18 v53.57,3.18 62.04,3.18 65.4,6.53 65.4,18.5 64.66,19.24 | v51.95,19.31 54.06,19.31 IC1.75 | 67.23,32.36 C7.1 | 67.23,32.36 67.37,32.36 68.1,32.36 68.94,33.19 70.44,33.19 C23.1 70.48,33.55 71.25,34.31 74.14,34.31 74.34,34.11 74.34,32.76 C21.1 | IC4.14 64.66,28.4 | 64.66,28.4 66.68,28.4 67.34,29.06 67.34,32.25 67.23,32.36 | 64.66,19.24 64.66,28.4 | 59.69,14.28 64.66,19.24 | 59.69,14.28 59.57,14.16 59.57,12.49 J3.1 | IC1.65 59.64,14.34 59.69,14.28
  Top 0.305: IC1.26 40.34,4.89 39.62,4.17
  Top 0.406: USB.VCC 23.87,9.1 22.99,9.98 22.99,14.25 21.97,15.27 | 21.97,15.27 21.82,15.43 18.78,18.46 C1.+ | 21.97,15.27 30.66,15.27 34.83,11.11 34.83,6.04 | 34.83,6.04 34.83,5.26 35.92,4.17 39.62,4.17 39.62,6.36 v40.39,7.12 | 34.83,6.04 34.9,6.11 v36.26,6.11 | v88.21,34.21 88.27,34.16 R3.2 | v67.37,33.5 67.37,32.36
  Top 0.61: 10.61,21.47 16.79,21.47 C1.+ | C2.1 13.26,14.45 11.84,14.45 10.61,15.68 10.61,21.47 | 10.61,21.47 4.97,21.47 D1.1
  Bottom 0.254: v41.64,19.02 41.64,17.2 C16.1 C19.1 C15.1 41.7,8.29 41.64,8.23 | 41.64,8.23 40.48,7.08 40.44,7.08 v40.39,7.12 | v46.14,19.41 46.39,18.03 C17.1 48.47,18 C12.1 49.31,18.8 49.85,19.33 51.93,19.33 v51.95,19.31 | 41.64,8.23 45.91,8.23 C18.1 48.47,8.68 C20.1 49.31,7.39 49.65,7.05 v52.35,7.05 | v48.7,3.14 53.15,3.14 53.18,3.18 v53.57,3.18
  Bottom 0.406: v36.26,6.11 36.26,3.41 38.22,1.45 74,1.45 74.29,1.74 88.53,1.74 89.65,2.85 89.65,17.59 96.18,24.13 EXT_LED.2 100,25.7 100,41.74 98.99,42.75 93,42.75 92.46,42.22 IC2.3 88.21,35.42 88.21,34.92 | 88.21,34.92 v88.21,34.21 | 88.21,34.92 68.68,34.92 67.37,33.6 v67.37,33.5
5VDRIVE  (via drill 0.65)
  Top 0.61: D1.2 6.71,25.09 7.3,25.68 7.3,29.34 | 7.3,29.34 7.3,29.68 F1.2 | v7.3,32.7 7.3,29.34
  Bottom 0.61: v7.3,32.7 7.05,32.95 7.05,33.31 4.91,35.45 4.91,40.33 8.52,43.94 8.52,50.22 14.28,55.98 26.79,55.98 TERMPWR.1
!ACK  (via drill 0.35, 0.4)
  Top 0.254: IC1.91 44.89,21.14 44.89,22.93 45.06,23.1 45.23,23.1 49.59,27.45 49.59,29.27 50.16,29.85 IC5.2 50.16,34.78 50.58,35.2 50.48,35.2 v50.44,35.25 | v84.9,37.71 83.46,39.15 v83.46,45.27 83.46,55.32 82.8,55.98 SCSI50P.38
  Bottom 0.254: v50.44,35.25 50.44,35.59 50.96,36.11 83.3,36.11 v84.9,37.71 | TERMINATORS.17 65.35,45.27 v83.46,45.27
!ATN  (via drill 0.35, 0.4)
  Top 0.254: IC1.95 42.88,21.13 42.88,24.7 43.16,24.97 44.57,24.97 47.05,27.45 47.05,29.27 47.62,29.85 IC5.4 47.62,34.54 48.23,35.15 48.2,35.15 v48.11,35.25 | v81.38,38.21 79.79,39.8 v79.79,43.82 79.79,50.7 78.28,52.22 78.28,56.84 77.79,57.33 74.99,57.33 74.46,56.8 74.54,56.71 SCSI50P.32
  Bottom 0.254: v48.11,35.25 48.11,36.35 48.63,36.87 74.61,36.87 74.83,36.87 80.84,36.87 81.72,37.75 81.38,38.09 v81.38,38.21 | TERMINATORS.19 61.75,43.78 79.75,43.78 v79.79,43.82
!BSY  (via drill 0.35, 0.4)
  Top 0.254: IC1.92 44.34,23.35 44.46,23.48 45.08,23.48 48.88,27.28 48.88,28.38 IC5.12 48.89,29.31 49.47,29.89 49.47,34.9 49.7,35.12 49.7,35.13 v49.58,35.25 | v83.16,37.83 80.97,40.02 v80.97,44.57 80.97,55.32 80.31,55.98 SCSI50P.36
  Bottom 0.254: v49.58,35.25 49.58,35.88 50.19,36.49 76.99,36.49 77.17,36.49 82.05,36.49 83.27,37.71 | 83.27,37.71 | 83.27,37.71 v83.16,37.83 | TERMINATORS.18 63.51,44.57 v80.97,44.57
!C/D  (via drill 0.35)
  Top 0.254: IC1.80 50.37,21.12 50.37,22.66 53.58,25.86 56.69,25.86 58.36,27.54 58.36,29.92 59.06,30.61 IC4.4 59.06,35.72 59.38,36.04 78.28,36.04 87.32,36.04 87.48,36.04 92.46,36.04 93.79,37.38 v93.79,51.22 93.79,54.51 SCSI50P.45
  Bottom 0.254: TERMINATORS.13 74.99,51.14 93.72,51.14 v93.79,51.22
!DB0  (via drill 0.35)
  Top 0.254: IC1.19 38.56,10.37 36.68,10.37 32.38,14.66 IC6.8 32.38,31.14 32.94,31.69 32.94,32.93 32.96,32.96 v32.96,37.21 32.96,45 34.93,46.97 34.93,55.42 35.49,55.98 SCSI50P.2
  Bottom 0.254: TERMINATORS.10 77.4,37.87 76.78,37.25 33.01,37.25 v32.96,37.21
!DB1  (via drill 0.35)
  Top 0.254: IC1.18 38.56,10.81 36.8,10.81 33.08,14.52 33.08,29.27 33.66,29.85 IC6.6 33.66,44.51 v34.67,45.53 37.75,48.61 37.75,54.75 SCSI50P.4
  Bottom 0.254: TERMINATORS.2 57.08,43.68 55.43,45.32 34.88,45.32 v34.67,45.53
!DB2  (via drill 0.35)
  Top 0.254: IC1.9 38.56,15.31 37.18,15.31 34.63,17.86 34.63,21.91 34.92,22.21 IC6.10 34.92,29.31 35.5,29.89 35.5,44.51 40.33,49.33 v40.33,50.36 40.33,54.79 SCSI50P.6
  Bottom 0.254: TERMINATORS.3 59.62,43.43 55.78,47.27 55.78,49.66 55.08,50.36 v40.33,50.36
!DB3  (via drill 0.35)
  Top 0.254: IC1.8 38.56,15.81 37.3,15.81 37.15,15.96 37.08,15.96 35.01,18.02 35.01,21.75 35.62,22.36 35.62,29.27 36.2,29.85 IC6.4 v36.2,39.13 36.2,43.57 42.87,50.24 42.87,55.36 43.49,55.98 SCSI50P.8
  Bottom 0.254: TERMINATORS.5 64.7,39.72 64.14,39.16 47.89,39.16 47.03,40.02 37.09,40.02 v36.2,39.13
!DB4  (via drill 0.35)
  Top 0.254: IC1.5 38.56,17.37 37.33,17.37 37.33,17.39 36.15,18.56 36.15,21.28 37.47,22.59 IC6.12 37.47,29.31 38.04,29.89 38.04,35.52 | 38.04,35.52 38.06,35.54 | 38.04,35.52 38.04,42.97 45.38,50.31 v45.38,51.14 45.38,55.07 46.29,55.98 SCSI50P.10
  Bottom 0.254: TERMINATORS.4 62.16,41.43 56.16,47.42 56.16,49.81 54.84,51.14 v45.38,51.14
!DB5  (via drill 0.35)
  Top 0.254: IC1.4 37.41,17.84 37.41,17.85 36.53,18.73 36.53,21.12 38.16,22.75 38.16,29.27 38.73,29.85 IC6.2 v38.73,37.84 38.73,41.41 48.02,50.7 48.02,55.13 48.87,55.98 SCSI50P.12
  Bottom 0.254: TERMINATORS.9 74.86,38.38 74.11,37.63 38.94,37.63 v38.73,37.84
!DB6  (via drill 0.35, 0.4)
  Top 0.254: v40.62,23.13 40.64,26.44 41.16,26.93 42.63,28.4 IC5.8 43.81,32.38 44.39,32.96 v44.39,39.44 44.39,44.69 50.48,50.77 50.48,55.06 51.4,55.98 SCSI50P.14 | v38.85,20.95 38.85,19.6 IC1.1
  Bottom 0.254: v40.62,23.13 40.85,22.88 38.91,20.95 v38.85,20.95 | TERMINATORS.6 67.24,39.09 66.92,38.78 47.73,38.78 47.33,39.18 44.66,39.18 v44.39,39.44
!DB7  (via drill 0.35)
  Top 0.254: IC5.6 45.09,29.85 44.39,29.16 44.39,27.54 44.25,27.39 44.21,27.39 43.91,27.09 42.28,27.09 41.22,26.03 41.22,23.4 41.23,23.38 41.23,22.71 40.85,22.33 IC1.99 | IC5.6 45.09,34.45 | IC5.6 v45.09,38.46 45.09,42.85 53.03,50.8 53.03,55.34 53.68,55.98 SCSI50P.16
  Bottom 0.254: TERMINATORS.7 69.78,39.01 69.16,38.4 47.58,38.4 47.17,38.8 46.69,38.8 46.29,38.4 45.15,38.4 v45.09,38.46
!DBP  (via drill 0.35)
  Top 0.254: IC1.96 42.38,21.13 42.38,22.03 42.5,22.15 42.5,25.11 42.83,25.44 44.42,25.44 46.36,27.37 IC5.10 46.36,29.31 46.93,29.89 v46.93,38.22 46.93,43.07 55.53,51.67 55.53,54.75 SCSI50P.18
  Bottom 0.254: TERMINATORS.8 72.32,38.85 71.48,38.02 47.13,38.02 v46.93,38.22
!I/O  (via drill 0.35)
  Top 0.254: IC1.76 52.39,21.14 52.39,22.37 54.32,24.3 57.66,24.3 60.9,27.54 60.9,29.16 61.59,29.85 IC4.2 61.59,35.08 61.79,35.28 95.44,35.28 98.67,38.51 v98.67,48.52 98.67,54.71 SCSI50P.49
  Bottom 0.254: TERMINATORS.11 98.62,48.46 v98.67,48.52
!MSG  (via drill 0.35)
  Top 0.254: 52.47,27.05 52.8,27.39 55.67,27.39 55.82,27.54 55.82,30.41 56.52,31.1 IC4.6 56.52,34.49 57.73,35.7 | 52.47,27.05 | 52.47,27.05 48.34,22.93 IC1.84 | 57.73,35.7 | 57.73,35.7 58.83,36.8 83.01,36.8 83.16,36.8 87.02,36.8 88.57,38.36 v88.57,46.68 88.57,54.65 SCSI50P.41
  Bottom 0.254: TERMINATORS.15 68.98,46.72 87.65,46.72 87.69,46.68 v88.57,46.68
!REQ  (via drill 0.35)
  Top 0.254: IC1.77 51.87,21.11 51.87,22.42 54.12,24.68 57.31,24.68 60.33,27.69 IC4.12 60.33,30.93 60.9,31.51 60.9,35.33 61.23,35.66 94.77,35.66 96.1,37 v96.1,50.28 96.1,54.74 SCSI50P.47
  Bottom 0.254: TERMINATORS.12 76.71,50.32 96.06,50.32 v96.1,50.28
!RST  (via drill 0.35, 0.4)
  Top 0.254: IC1.85 47.84,22.99 48.63,23.78 48.63,23.79 53.14,28.3 55.14,28.3 IC4.8 55.25,32.38 55.82,32.96 55.82,34.7 55.8,34.72 55.8,35.18 v55.88,35.25 | v86.41,38.13 85.96,38.59 v85.96,46.02 85.96,55.55 85.53,55.98 SCSI50P.40
  Bottom 0.254: v55.88,35.25 55.88,35.27 56.33,35.73 79.26,35.73 79.55,35.73 84.2,35.73 86.49,38.02 86.49,38.06 v86.41,38.13 | TERMINATORS.16 67.14,46.02 v85.96,46.02
!SEL  (via drill 0.35)
  Top 0.254: IC1.81 49.86,21.1 49.86,22.68 53.42,26.24 56.34,26.24 57.78,27.69 IC4.10 57.78,30.68 58.36,31.26 58.36,35.79 58.99,36.42 89.7,36.42 91.03,37.75 v91.03,52 91.03,54.73 SCSI50P.43
  Bottom 0.254: TERMINATORS.14 73.2,51.88 90.91,51.88 v91.03,52
ACK
  Top 0.254: IC5.1 51.44,29.85 50.86,29.27 50.86,27.52 45.87,22.54 45.87,21.12 IC1.89
ATN
  Top 0.254: IC5.3 48.89,29.85 48.32,29.27 48.32,27.49 44.77,23.95 44.02,23.95 43.83,23.76 IC1.93
BB1
  Top 0.61: REG.1 28.5,33.38 28.97,32.91 28.97,24.16 C11.1 29,24.02 30.59,22.42 30.59,21.69 R5.2 30.7,21.25 29.71,20.27 29.36,20.27 29,19.91 R4.1
BSY
  Top 0.254: IC5.13 50.16,27.44 45.42,22.7 45.42,21.17 IC1.90
C/D
  Top 0.254: IC4.3 60.33,31.47 59.63,30.78 59.63,27.54 57.16,25.06 53.91,25.06 51.39,22.54 51.39,21.14 IC1.78
D+
  Top 0.254: R2.1 32.81,11.85 33.67,10.99 33.67,4.87 35.05,3.49 44.02,3.49 44.87,4.34 44.87,5.55 IC1.35
D-  (via drill 0.4)
  Top 0.254: R1.1 24.74,10.81 24.8,10.75 v24.8,10.63 | v26.63,10.75 32.66,10.75 33.29,10.12 33.29,4.72 34.9,3.11 43.86,3.11 | 43.86,3.11 | 43.86,3.11 44.22,3.11 45.36,4.25 45.36,5.56 IC1.36
  Bottom 0.254: v24.8,10.63 26.47,10.63 26.51,10.67 26.55,10.67 v26.63,10.75
DB0
  Top 0.254: IC6.9 33.66,14.55 36.81,11.4 36.82,11.4 36.91,11.31 38.56,11.31 IC1.17
DB1
  Top 0.254: IC6.5 34.92,29.85 34.25,29.17 34.25,14.5 36.97,11.78 38.53,11.78 IC1.16
DB2
  Top 0.254: IC6.11 36.2,22.4 35.39,21.6 35.39,18.18 37.24,16.34 IC1.7
DB3
  Top 0.254: IC6.3 37.47,29.85 36.89,29.27 36.89,22.55 35.77,21.44 35.77,18.38 37.17,16.98 37.18,16.98 37.35,16.81 38.56,16.81 IC1.6
DB4
  Top 0.254: IC6.13 38.73,22.79 36.91,20.97 36.91,18.88 37.44,18.36 38.57,18.36 IC1.3
DB5
  Top 0.254: IC6.1 40,29.85 39.43,29.27 39.43,22.94 37.3,20.81 37.3,19.04 37.5,18.84 IC1.2
DB6
  Top 0.254: IC5.9 45.09,27.57 43.99,26.48 42.38,26.48 41.69,25.79 41.69,22.48 41.36,22.15 41.36,21.11 IC1.98
DB7
  Top 0.254: IC5.5 46.36,29.85 45.78,29.27 45.78,27.51 44.22,25.95 42.54,25.95 42.09,25.5 42.09,22.35 42.07,22.32 41.88,22.14 41.88,21.13 IC1.97
DBP
  Top 0.254: IC5.11 47.62,27.46 44.67,24.5 43.61,24.5 43.34,24.23 IC1.94
GND  (via drill 0.35, 0.4)
  Top 0.254: v57.78,16.58 57.83,16.52 57.89,16.52 56.2,14.84 IC1.66 54.08,14.84 53.02,14.84 53.02,14.8 53.01,14.79 53.01,14.71 52.92,14.62 52.92,14.07 53.16,13.84 IC1.64 54.1,13.84 55.56,13.84 55.77,13.63 55.77,13.07 55.54,12.84 IC1.62 IC1.61 IC1.60 IC1.59 IC1.58 IC1.57 IC1.56 59.46,9.84 J3.3 | v48.48,15.8 46.81,15.8 v46.34,16.27 | v46.34,16.27 44.83,16.27 44.58,16.02 | 44.58,16.02 | 44.58,16.02 v44.6,16 | 47.5,5.58 IC1.40 | 47.75,5.58 47.5,5.58 | 47.75,5.58 IC1.41 | IC1.44 IC1.43 48.84,6.67 | 48.84,6.67 48.86,6.66 49.3,6.66 v50.84,8.2 v50.84,8.18 | 47.5,5.58 47.67,5.75 47.67,6.74 47.8,6.87 48.65,6.87 48.84,6.67 | IC1.38 46.45,5.47 46.45,4.68 46.6,4.53 47.53,4.53 47.54,4.53 47.54,5.37 47.75,5.58 | J3.3 J3.2 | J3.3 J3.4 J3.5 | IC1.13 IC1.14 | IC1.13 IC1.12 | v42.51,14.82 39.86,14.82 | 39.86,14.82 38.6,14.82 IC1.10 | 39.86,14.82 39.86,13.55 39.62,13.32 38.62,13.32 38.61,13.31 IC1.13 | USB.GND 26.47,9.04 27.21,9.79 27.21,9.83 v27.35,9.96 | v36.9,13.33 IC1.13 | C7.2 66.19,30.66 66.24,30.7 66.24,30.72 v66.26,30.74 | C14.2 27.92,36.63 29.21,35.34 29.25,35.34 v29.29,35.31 | IC1.87 46.84,16.77 v46.34,16.27 | IC1.22 36.8,8.84 36.73,8.91 36.73,9.5 v36.74,9.51
  Top 0.406: v98.64,31.86 97.53,31.86 Q1.2
  Top 0.61: C1.- 16.24,17.34 17.73,15.85 17.73,14.46 C2.2 C3.2
  Bottom 0.254: v57.78,16.58 51.58,16.58 C12.2 51.02,16.7 50.07,15.75 | 50.07,15.75 48.27,13.95 48.27,12.51 48.72,12.06 50.48,12.06 | 50.48,12.06 50.66,12.06 50.99,12.4 50.99,13.31 C13.2 | 50.07,15.75 48.61,15.75 48.54,15.82 48.51,15.82 v48.48,15.8 | v44.6,16 44.54,16 C16.2 C19.2 | C15.2 45.5,9.53 C18.2 C19.2 | 50.48,12.06 51.02,11.53 C20.2 50.84,9.35 v50.84,8.18 | C19.2 43.39,13.93 v42.51,14.82 | v27.35,9.96 27.45,9.96 30.54,13.05 36.43,13.05 36.72,13.34 36.88,13.34 v36.9,13.33 36.74,13.16 v36.74,9.51 | v66.26,30.74 69.68,30.74 v70.45,31.52 | v29.29,35.31 31.84,35.31 v31.89,35.35 31.89,32.81 32.96,31.74 40.93,31.74 | 40.93,31.74 41.96,32.77 41.96,34.52 v41.86,34.62 | 40.93,31.74 52.27,31.74 53.43,32.91 53.43,34.49 v53.33,34.59
  Bottom 0.406: IC2.1 98.77,37.94 98.77,31.95 98.68,31.86 v98.64,31.86
  other vias: 75.57,33.2 80.65,21.81
  pour Bottom (isolate 0.254): -1.12,67.12 101.6,66.69 101.6,0 23.74,-0.25 16.02,-0.28 -1.12,-0.28
  pour Top (isolate 0.254): -0.58,67.75 101.6,67.17 101.6,0 26.96,-0.09 14.9,-0.02 -0.58,-0.02
I/O
  Top 0.254: IC4.1 62.86,29.85 62.29,29.27 62.29,27.54 62.31,27.52 56.58,21.79 56.58,19.39 55.51,18.32 54.11,18.32 IC1.73
MSG
  Top 0.254: IC4.5 57.78,31.22 57.09,30.53 57.09,27.54 56.18,26.62 53.22,26.62 49.32,22.73 49.32,21.1 IC1.82
N$1
  Top 0.61: J4.3 5.88,46.04 J1.1 5.88,46.28 2.73,43.13 2.73,29.79 F1.1
N$2
  Top 0.254: USB.D+ 25.17,9.41 25.8,10.04 25.8,12.37 R2.2
N$3
  Top 0.254: USB.D- 24.52,9.52 23.62,10.42 23.62,12.42 R1.2
N$6  (via drill 0.4)
  Top 0.254: R3.1 88.27,23.54 88.02,23.29 88.02,17.05 90.38,14.69 90.38,11.95 90.59,11.75 90.59,11.72 v90.67,11.63 | v95.41,4.66 ACT.A
  Bottom 0.254: v90.67,11.63 90.67,6.86 92.88,4.66 95.32,4.66 95.35,4.63 95.38,4.63 v95.41,4.66
N$7  (via drill 0.4)
  Top 0.254: R7.1 73.03,30.2 71.67,28.85 67.67,28.85 66.84,28.02 65.88,28.02 65.49,27.63 65.49,27.62 v65.48,27.6 | v55.88,17.32 54.1,17.32 IC1.71
  Bottom 0.254: v65.48,27.6 63.2,27.6 57.25,21.66 57.25,18.65 55.93,17.33 55.89,17.33 v55.88,17.32
N$8  (via drill 0.65)
  Top 0.61: D2.2 12.06,30.09 15.13,33.16 15.13,33.31 v15.18,33.36
  Bottom 0.61: v15.18,33.36 23.47,33.36 27.89,37.79 27.89,49.77 TERMPWR.2
N$9  (via drill 0.4)
  Top 0.254: IC1.86 47.34,19.54 47.37,19.51 | 47.37,19.51 | 47.37,19.51 v47.54,19.43 | v48.06,18.82 48.06,17.4 47.84,17.18 47.86,17.18 v47.89,17.15 | v47.86,9.41 47.86,7.79 46.88,6.81 46.88,5.63 IC1.39
  Bottom 0.254: v47.54,19.43 47.95,19.45 48.06,18.84 v48.06,18.82 | v47.89,17.15 47.89,9.48 47.96,9.41 v47.86,9.41
N$10  (via drill 0.4)
  Top 0.254: R7.2 73.03,33.22 74.14,32.1 74.14,30.91 74.84,30.21 v75.5,30.21 | v91.28,30.17 95.11,30.17 95.6,30.65 95.6,31.89 Q1.1
  Bottom 0.254: v75.5,30.21 79.28,30.21 79.41,30.34 91.09,30.34 91.3,30.13 91.3,30.15 v91.28,30.17
N$12
  Top 0.254: R8.1 92.45,31.54 94.86,33.94 96.34,33.94 Q1.3
N$16  (via drill 0.35, 0.4)
  Top 0.254: R8.2 92.35,33.23 92.46,33.12 | 92.46,33.12 | 92.46,33.12 v92.59,32.99 | v93.95,23.44 95.8,21.59 EXT_LED.1
  Bottom 0.254: v92.59,32.99 92.59,27.43 93.87,26.14 93.87,23.57 93.95,23.49 v93.95,23.44
N$34  (via drill 0.4)
  Top 0.254: v52.54,13.3 54.06,13.3 IC1.63
  Bottom 0.254: C13.1 49.31,13.97 49.85,14.5 51.61,14.5 52.76,13.35 52.59,13.35 v52.54,13.3
N$35  (via drill 0.4)
  Top 0.254: IC1.72 55.54,17.84 55.63,17.93 62.27,17.93 62.27,17.97 v62.26,17.99 | v67.78,18.04 74.45,18.04 77.25,15.25 85.6,15.25 94.09,6.75 ACT.C
  Bottom 0.254: v62.26,17.99 67.72,17.99 67.75,18.01 | 67.75,18.01 | 67.75,18.01 v67.78,18.04
NN  (via drill 0.4)
  Top 0.61: v8.59,23.3 9.86,24.57 D2.1 13.52,24.57 14.75,25.8 14.75,30.42 REG.3 17.71,38.22 18.97,39.48 20.04,39.48 C14.1 25.17,39.43 33.54,47.8 33.54,56.34 34.68,57.48 66.24,57.48 66.92,56.8 SCSI50P.26 | v14.33,11.94 16.29,11.94 C3.1
  Bottom 0.61: v8.59,23.3 8.59,15.12 11.7,12 14.27,12 v14.33,11.94
REQ
  Top 0.254: IC1.74 55.48,18.84 56.09,19.44 56.09,21.89 61.55,27.35 61.55,28.36 IC4.13
RST
  Top 0.254: IC4.9 56.2,28.09 56.2,27.38 55.83,27 53.06,27 48.86,22.8 48.86,21.1 IC1.83
SD_CD  (via drill 0.4)
  Top 0.254: IC1.49 51.84,2.61 52.17,2.27 61.76,2.27 65.19,5.71 65.82,5.71 | 65.82,5.71 | v68.62,6.63 68.64,6.61 68.64,6.49 67.86,5.71 65.82,5.71 | v68.62,20.95 68.62,21.54 69.64,22.56 69.64,23.49 68.96,24.17 J2.10
  Bottom 0.254: SD1.9 86.56,15.19 86.56,6.44 85.5,5.38 76.49,5.38 75.89,4.77 SD1.S1 70.25,6.63 v68.62,6.63 v68.62,20.95
SD_CS  (via drill 0.4)
  Top 0.254: IC1.48 51.34,2.4 51.88,1.85 61.88,1.85 65.35,5.32 65.67,5.32 | 65.67,5.32 | v78.94,8.33 78.91,8.3 78.91,8.13 78.25,7.47 71,7.47 68.85,5.32 65.67,5.32 | v78.91,16.76 78.91,23.89 78.03,24.78 78.03,28.63 78.4,28.99 86.46,28.99 86.9,28.55 86.9,25.84 J2.1
  Bottom 0.254: v78.94,8.33 78.94,15.21 SD1.2 78.91,16.69 78.86,16.73 78.89,16.73 v78.91,16.76
SD_MISO  (via drill 0.4)
  Top 0.254: v71.83,23.99 71.83,25.77 J2.7 | IC1.45 49.95,5.47 49.95,1.9 51.16,0.69 62.33,0.69 65.81,4.17 69.31,4.17 71.47,6.33 82.35,6.33 84.43,8.4 84.43,8.55 v84.4,8.57
  Bottom 0.254: v71.83,23.99 71.85,24.02 71.85,24.04 72.34,24.53 81.97,24.53 84.41,22.1 SD1.7 v84.4,8.57
SD_MOSI  (via drill 0.4)
  Top 0.254: IC1.47 50.84,2.28 51.66,1.46 62.03,1.46 65.51,4.94 69.01,4.94 71.16,7.09 79.76,7.09 80.33,7.66 80.33,8.2 v80.16,8.38 | v79.97,16.88 79.97,23.75 80.5,24.29 80.5,28.31 80.81,28.61 84.12,28.61 84.4,28.33 J2.2
  Bottom 0.254: v80.16,8.38 80.16,15.09 SD1.3 80.01,16.8 80.02,16.81 80.02,16.83 v79.97,16.88
SD_SCK  (via drill 0.4)
  Top 0.254: IC1.46 50.34,2.05 51.32,1.07 62.17,1.07 65.65,4.55 69.16,4.55 71.31,6.71 81.41,6.71 82.2,7.49 v82.2,8.25 | v77.1,23.72 77.1,25.61 J2.5
  Bottom 0.254: v82.2,8.25 82.2,15.23 SD1.5 82.21,16.9 82.25,16.93 82.25,23.06 81.68,23.62 77.2,23.62 77.07,23.75 | 77.07,23.75 | 77.07,23.75 v77.1,23.72
SEL
  Top 0.254: IC4.11 59.06,27.69 56.85,25.48 56.52,25.48 56.47,25.44 53.73,25.44 50.9,22.61 50.9,21.14 IC1.79
TCKC  (via drill 0.4)
  Top 0.254: IC1.21 44.17,9.34 47.17,12.34 52.51,12.34 52.47,12.37 52.6,12.5 52.67,12.5 v52.69,12.47 | v61.43,11.2 63.38,11.2 J3.7
  Bottom 0.254: v52.69,12.47 60.16,12.47 v61.43,11.2 | v61.43,11.2 61.48,11.15 v61.43,11.2
TDI  (via drill 0.4)
  Top 0.254: IC1.24 45.86,7.83 v46.22,7.48 | v61.65,8.62 63.41,8.62 J3.9
  Bottom 0.254: v46.22,7.48 46.22,4.53 47.15,3.59 48.3,3.59 48.48,3.78 60.8,3.78 61.41,4.39 61.41,8.38 v61.65,8.62
TDOC  (via drill 0.4)
  Top 0.254: IC1.23 43.71,8.34 47.08,11.71 52.24,11.71 v52.26,11.73 | v61.62,9.91 63.41,9.91 J3.8
  Bottom 0.254: v52.26,11.73 59.75,11.73 61.53,9.94 61.58,9.94 v61.62,9.91
TMSC  (via drill 0.4)
  Top 0.254: IC1.20 44.08,9.84 49.16,14.91 52.56,14.91 52.63,14.98 52.63,14.93 v52.35,14.91 | v63.44,13.74 63.44,12.46 J3.6
  Bottom 0.254: v52.35,14.91 62.25,14.91 63.42,13.74 v63.44,13.74
XRESC  (via drill 0.4)
  Top 0.254: IC1.15 46.04,12.34 49,15.29 51.79,15.28 52.68,15.87 52.65,15.87 v52.61,15.9 | v63.54,6 63.54,7.24 J3.10
  Bottom 0.254: v52.61,15.9 62.35,15.9 64.27,13.98 64.27,6.74 63.52,6 v63.54,6

### Text on the board
tNames: CONN IS / FLIPPED | 5V | GND | GND | +12V | + | PSoC 5lp | JTAG | SCSI2SD 4.2c BY / MICHAEL MCMASTER / SCSI2SD TINY / REWORK BY / @EDU_ARANA | + | Rev. 0.4 | SCSI2SD TINY - REWORK BY @EDU_ARANA